# EAGLE design untitled (EAGLE 9.6.2)
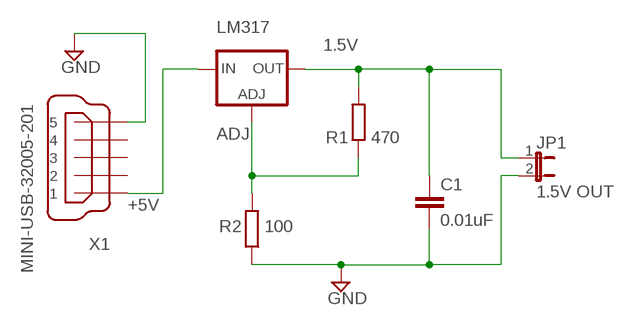
[diagram p0: schematic, sheet 1]

## Parts
C1  0.01uF  C-EU050-025X075  [C050-025X075]
JP1  1.5V OUT  JP1E  [JP1]
LM317  LM317TL  [317TL]
R1  470  R-EU_0204/7  [0204/7]
R2  100  R-EU_0204/7  [0204/7]
X1  MINI-USB-32005-201  [32005-201]

## Nets
1.5V: C1.1 JP1.1 LM317.2(OUT) R1.2
+5V: LM317.3(IN) X1.1
ADJ: LM317.1(ADJ) R1.1 R2.2
GND: C1.2 JP1.2 R2.1 X1.5
Unconnected: X1.2 X1.3 X1.4

## Library data of the parts
C1 = rcl:C-EU: CAPACITOR, European symbol; SPICEPREFIX: C
JP1 = jumper:JP1E: JUMPER
LM317 = v-reg:LM317TL: VOLTAGE REGULATOR
R1 R2 = rcl:R-EU_: RESISTOR, European symbol; SPICEPREFIX: R
X1 = con-cypressindustries:MINI-USB-: MINI USB-B Conector Source: www.cypressindustries.com; OC_FARNELL: unknown; OC_NEWARK: unknown

## Board
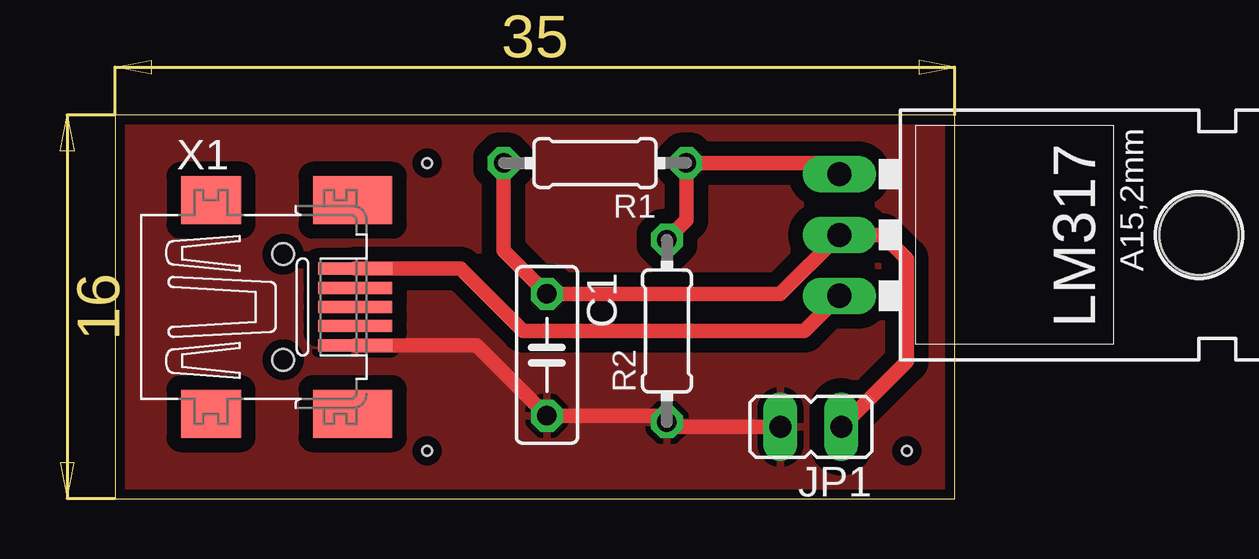
[diagram p1: board, top side]

Size 35 x 16 mm. Coordinates in mm from the lower left corner, seen from the top.
Outline: 0,0 35,0 35,16 0,16 0,0
Copper layers (1*16): Top 0.035mm / dielectric 1.5mm / Bottom 0.035mm
Design rules "default *": minimum track width 6mil, minimum drill 0.35mm, track to track 0.6mm, track to pad 0.2mm, pad to pad 0.2mm, via to via 0.4mm, smd to smd 6mil, copper to edge 0.4mm, drill to drill 1mm, minimum pad ring 10mil, minimum via ring 8mil, stop-mask expansion 4mil, vias tented up to drill 0mil, thermal gap 10mil
Holes 0.4 mm at 13,14 13,2 33,2

### Footprints (pad centres in the part's own frame; a part is rotated, then mirrored left to right if it is on the bottom)
C050-025X075 = drill 0.813 octagon: 1 -2.54,0; 2 2.54,0
JP1 = drill 0.914 long: 1 0,-1.27; 2 0,1.27
317TL = drill 1.016 long: 1 -2.54,-3.81; 2 0,-3.81; 3 2.54,-3.81 | hole 3.302: 0,11.176
0204/7 = drill 0.813 octagon: 1 -3.81,0; 2 3.81,0
32005-201 = smd 3.1 x 0.5: 1 3,1.6; 2 3,0.8; 3 3,0; 4 3,-0.8; 5 3,-1.6 | smd 2.5 x 2: M1 -3,-4.45; M2 -3,4.45 | smd 3.3 x 2: M3 2.9,4.45; M4 2.9,-4.45 | hole 0.9: 0,2.2; 0,-2.2

### Placement (x,y rotation side)
C1  18,6 270 top
JP1  29,3 90 top
LM317  34,11 270 top
R1  20,14 180 top
R2  23,7 90 top
X1  7,8 0 top

### Tracks (layer width: path | path; a pad name or v marks a point on that pad's centre or on a via)
1.5V
  Top 0.61: R1.2 16.19,10.35 C1.1 27.72,8.54 28.9,9.73 28.92,9.73 LM317.2 32,11 33,10 33,5.73 JP1.1
+5V
  Top 0.61: X1.1 14.4,9.6 17,7 28.73,7 LM317.3
ADJ
  Top 0.61: R2.2 23.81,11.62 R1.1 29.73,14 LM317.1
GND
  Top 0.61: X1.5 15.06,6.4 C1.2 22.73,3.46 R2.1 23.19,3 JP1.2
  pour Top: 0,16 35,16 35,0 0,0

### Text on the board
bNames: 5V->1.5V